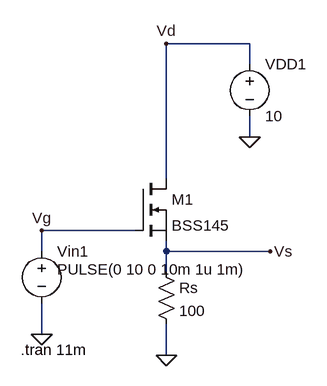
[diagram p0: schematic lab5.2b.asc]
lab5.2b.asc, the LTspice schematic file:
Version 4
SHEET 1 880 680
WIRE 336 -144 208 -144
WIRE 336 -112 336 -144
WIRE 336 0 336 -32
WIRE 208 64 208 -144
WIRE 160 144 16 144
WIRE 16 176 16 144
WIRE 208 176 208 160
WIRE 368 176 208 176
WIRE 208 208 208 176
WIRE 16 304 16 256
WIRE 208 336 208 288
FLAG 336 0 0
FLAG 16 304 0
FLAG 16 144 Vg
FLAG 368 176 Vs
FLAG 208 336 0
FLAG 208 -144 Vd
SYMBOL voltage 336 -128 R0
WINDOW 123 0 0 Left 0
WINDOW 39 0 0 Left 0
SYMATTR InstName VDD1
SYMATTR Value 10
SYMBOL nmos 160 64 R0
SYMATTR InstName M1
SYMATTR Value BSS145
SYMBOL voltage 16 160 R0
WINDOW 3 24 44 Left 2
WINDOW 123 0 0 Left 0
WINDOW 39 0 0 Left 0
SYMATTR Value PULSE(0 10 0 10m 1u 1m)
SYMATTR InstName Vin1
SYMBOL res 192 192 R0
SYMATTR InstName Rs
SYMATTR Value 100
TEXT -16 328 Left 2 !.tran 11m

The netlist it stands for:
* lab5.2b.asc
VDD1 Vd 0 10
M1 Vd Vg Vs Vs BSS145
Vin1 Vg 0 PULSE(0 10 0 10m 1u 1m)
Rs Vs 0 100
.model NMOS NMOS
.model PMOS PMOS
.lib standard.mos
.tran 11m
.backanno
.end